# Altium schematic sheet SCH_2021-11-04.schdoc
size 319 x 219 mm
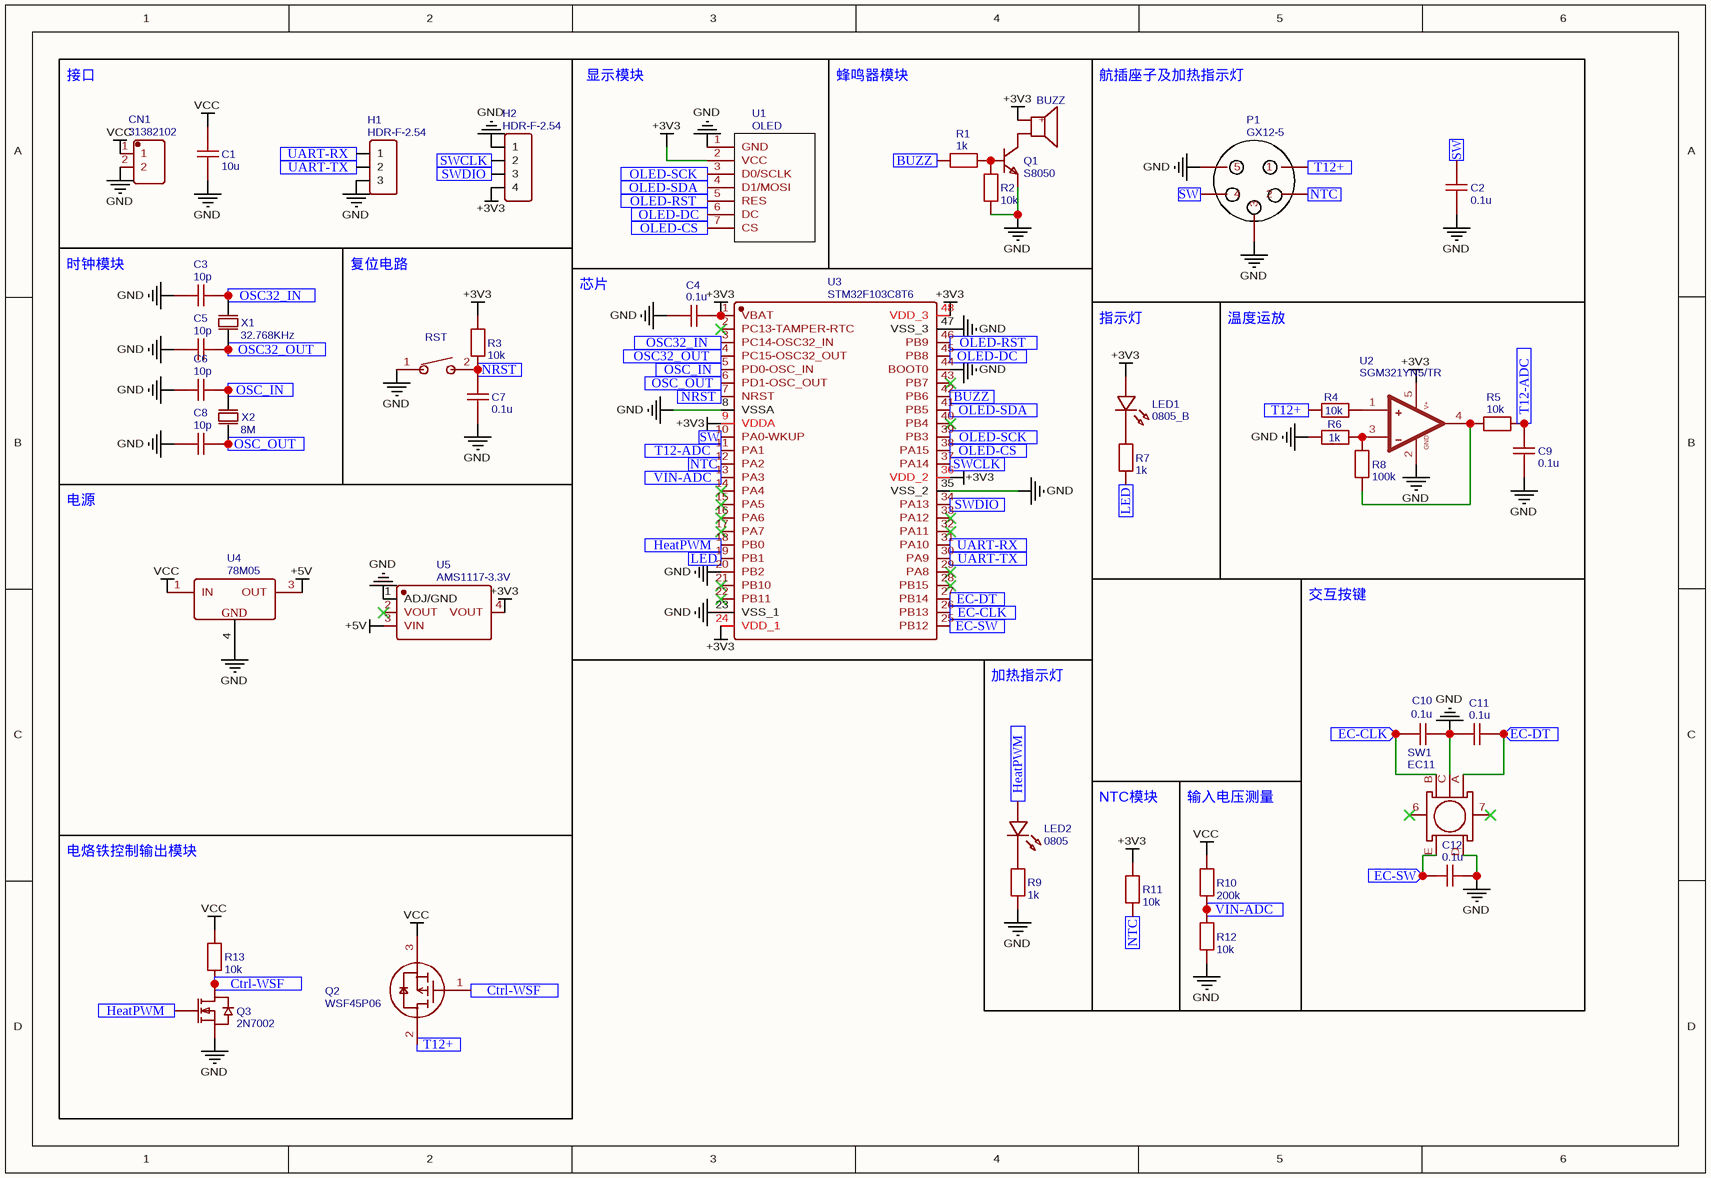
[diagram p0: SCH_2021-11-04.schdoc]

## Parts
BUZZ  TMB12A12  [BUZ-TH_BD12.0-P7.60-D0.6-FD]  (value not drawn)
C1  10u  [C0805]
C2  0.1u  [C0603]
C3  10p  [C0603]
C4  0.1u  [C0603]
C5  10p  [C0603]
C6  10p  [C0603]
C7  0.1u  [C0603]
C8  10p  [C0603]
C9  0.1u  [C0603]
C10  0.1u  [C0603]
C11  0.1u  [C0603]
C12  0.1u  [C0603]
CN1  31382102  [CONN-TH_2P-P3.81_31382102]
H1  HDR-F-2.54  [HDR-F-2.54_1X3]
H2  HDR-F-2.54  [HDR-F-2.54_1X4]
LED1  0805_B  [LED0603_BLUE]
LED2  0805  [LED0603_GREEN]
P1  GX12-5  [GX12-5]
Q1  S8050  [SOT-23-3_L2.9-W1.3-P1.90-LS2.4-TR]
Q2  WSF45P06  [TO-252-2_L6.6-W6.1-P4.57-LS9.9-TL-CW]
Q3  2N7002  [SOT-23-3_L2.9-W1.3-P1.90-LS2.4-BR]
R1  1k  [R0603]
R2  10k  [R0603]
R3  10k  [R0603]
R4  10k  [R0603]
R5  10k  [R0603]
R6  1k  [R0603]
R7  1k  [R0603]
R8  100k  [R0603]
R9  1k  [R0603]
R10  200k  [R0603]
R11  10k  [R0603]
R12  10k  [R0603]
R13  10k  [R0603]
RST  TSA343G00-250J2  [SW-SMD_L4.0-W2.9-LS5.0]  (value not drawn)
SW1  EC11  [SW-TH_EC11XXXXXXXX]
U1  OLED  [HDR-M-2.54_1X7]
U2  SGM321YN5/TR  [SOT-23-5_L3.0-W1.7-P0.95-LS2.8-BR]
U3  STM32F103C8T6  [LQFP-48_L7.0-W7.0-P0.50-LS9.0-BL]
U4  78M05  [TO-252-2_L6.5-W6.1-P4.58-LS10.0-TL]
U5  AMS1117-3.3V  [SOT-223-4_L6.5-W3.5-P2.30-LS7.0-BR]
X1  32.768KHz  [OSC-SMD_2P-L3.2-W1.5]
X2  8M  [OSC-SMD_L5.0-W3.2]

## Blocks framed on the sheet
接口: C1 CN1 H1 H2
显示模块: U1
蜂鸣器模块: BUZZ Q1 R1 R2
航插座子及加热指示灯: C2 P1
时钟模块: C3 C5 C6 C8 X1 X2
复位电路: C7 R3 RST
芯片: C4 U3
指示灯: LED1 R7
温度运放: C9 R4-R6 R8 U2
电源: U4 U5
交互按键: C10-C12 SW1
加热指示灯: LED2 R9
NTC模块: R11
输入电压测量: R10 R12
电烙铁控制输出模块: Q2 Q3 R13

## Ports
BUZZ (in), Ctrl-WSF (in), EC-CLK (in), EC-DT (in), EC-SW (in), HeatPWM (in), LED (in), NRST (in), NTC (in), OLED-CS (in), OLED-DC (in), OLED-RST (in), OLED-SCK (in), OLED-SDA (in), OSC32_IN (in), OSC32_OUT (in), OSC_IN (in), OSC_OUT (in), SW (in), SWCLK (in), SWDIO (in), T12+ (in), T12-ADC (in), UART-RX (in), UART-TX (in), VIN-ADC (in)

## Nets
+3V3: BUZZ.1(+) C4.2 H2.4 LED1.1 R3.2 R11.1 U1.2(VCC) U2.5(V+) U3.1(VBAT) U3.9(VDDA) U3.24(VDD_1) U3.36(VDD_2) U3.48(VDD_3) U5.4(VOUT)
+5V: U4.3(OUT) U5.3(VIN)
GND: C1.1 C2.1 C3.1 C4.1 C5.1 C6.1 C7.2 C8.1 C9.1 C10.2 C11.1 C12.2 CN1.2 H1.3 H2.1 P1.3 P1.5 Q1.1(E) Q3.2(S) R2.1 R6.1 R9.1 R12.1 RST.1 SW1.C SW1.D U1.1(GND) U2.2(GND) U3.8(VSSA) U3.20(PB2) U3.23(VSS_1) U3.35(VSS_2) U3.44(BOOT0) U3.47(VSS_3) U4.4(GND) U5.1(ADJ/GND)
VCC: C1.2 CN1.1 Q2.3(S) R10.2 R13.2 U4.1(IN)
BUZZ: R1.1 U3.42(PB6) ; port BUZZ
Ctrl-WSF: Q2.1(G) Q3.3(D) R13.1 ; port Ctrl-WSF
EC-CLK: C10.1 SW1.B U3.26(PB13) ; port EC-CLK
EC-DT: C11.2 SW1.A U3.27(PB14) ; port EC-DT
EC-SW: C12.1 SW1.E U3.25(PB12) ; port EC-SW
HeatPWM: LED2.1 Q3.1(G) U3.18(PB0) ; port HeatPWM
LED: R7.1 U3.19(PB1) ; port LED
NRST: C7.1 R3.1 RST.2 U3.7(NRST) ; port NRST
NTC: P1.2 R11.2 U3.12(PA2) ; port NTC
OLED-CS: U1.7(CS) U3.38(PA15) ; port OLED-CS
OLED-DC: U1.6(DC) U3.45(PB8) ; port OLED-DC
OLED-RST: U1.5(RES) U3.46(PB9) ; port OLED-RST
OLED-SCK: U1.3(D0/SCLK) U3.39(PB3) ; port OLED-SCK
OLED-SDA: U1.4(D1/MOSI) U3.41(PB5) ; port OLED-SDA
OSC32_IN: C3.2 U3.3(PC14-OSC32_IN) X1.2(OSC2) ; port OSC32_IN
OSC32_OUT: C5.2 U3.4(PC15-OSC32_OUT) X1.1(OSC1) ; port OSC32_OUT
OSC_IN: C6.2 U3.5(PD0-OSC_IN) X2.2(OSC2) ; port OSC_IN
OSC_OUT: C8.2 U3.6(PD1-OSC_OUT) X2.1(OSC1) ; port OSC_OUT
SW: C2.2 P1.4 U3.10(PA0-WKUP) ; port SW
SWCLK: H2.2 U3.37(PA14) ; port SWCLK
SWDIO: H2.3 U3.34(PA13) ; port SWDIO
T12+: P1.1 Q2.2(D) R4.1 ; port T12+
T12-ADC: C9.2 R5.2 U3.11(PA1) ; port T12-ADC
UART-RX: H1.1 U3.31(PA10) ; port UART-RX
UART-TX: H1.2 U3.30(PA9) ; port UART-TX
VIN-ADC: R10.1 R12.2 U3.13(PA3) ; port VIN-ADC
NetBUZZ_2: BUZZ.2 Q1.3(C)
NetLED1_2: LED1.2 R7.2
NetLED2_2: LED2.2 R9.2
NetQ1_2: Q1.2(B) R1.2 R2.2
NetR4_2: R4.2 U2.1(+)
NetR5_1: R5.1 R8.2 U2.4(OUT)
NetR6_2: R6.2 R8.1 U2.3(-)

Not connected (* = marked no-connect by the designer): SW1 6* 7*; U3 2(PC13-TAMPER-RTC)* 14(PA4)* 15(PA5)* 16(PA6)* 17(PA7)* 21(PB10)* 22(PB11)* 28(PB15)* 29(PA8)* 32(PA11)* 33(PA12)* 40(PB4)* 43(PB7)*; U5 2(VOUT)*

## Library data of the parts
BUZZ = TMB12A12: BOM_Manufacturer: HNDZ; BOM_Supplier: LCSC; BOM_Manufacturer Part: TMB12A12; BOM_Supplier Part: C96079; BOM_JLCPCB Part Class: Extended Part; spicePre: B; spiceSymbolName: TMB12A12
C1 = 10u: nameAlias: Value(F); Contributor: LCEDA_Lib; spicePre: C; spiceSymbolName: C_0805_US
C2 C4 C7 C9-C12 = 0.1u: nameAlias: Value(F); Contributor: LCEDA_Lib; spicePre: C
  C2: spiceSymbolName: C_0805_US
  C4 C7 C9-C12: spiceSymbolName: C_0603_US
C3 C5 C6 C8 = 10p: nameAlias: Value(F); Contributor: LCEDA_Lib; spicePre: C; spiceSymbolName: C_0603_US
CN1 = 31382102: BOM_Manufacturer: METZ CONNECT; Contributor: LCSC; BOM_Supplier: LCSC; BOM_Manufacturer Part: 31382102; BOM_Supplier Part: C123238; BOM_JLCPCB Part Class: Extended Part; spicePre: C; spiceSymbolName: 31382102
H1 H2 = HDR-F-2.54: Contributor: LCEDA_Lib; BOM_Supplier: LCSC; spicePre: H
  H1: BOM_Supplier Part: C146690; spiceSymbolName: HDR-F-2.54_1x3
  H2: BOM_Supplier Part: C225501; spiceSymbolName: HDR-F-2.54_1x4
LED1 = 0805_B: BOM_Manufacturer: 方舟 ARKLED; BOM_Manufacturer Part: D-B080508B1-KS2; Contributor: LCEDA_Lib; BOM_Supplier Part: C108412; spicePre: L; spiceSymbolName: LED-0805_B
LED2 = 0805: BOM_Manufacturer: 国星光电; BOM_Manufacturer Part: NCD0805G1; Contributor: LCEDA_Lib; BOM_Supplier Part: C84260; spicePre: L; spiceSymbolName: LED-0805_G
P1 = GX12-5: BOM_Manufacturer Part: GX16-5-01; Contributor: czwa; spicePre: P; spiceSymbolName: GX12-5
Q1 = S8050: BOM_Manufacturer: KEC; BOM_Manufacturer Part: 2n3904S-RTK/PS; BOM_Paste Type: SOT-23; Contributor: LCEDA_Lib; BOM_Supplier: LCSC; BOM_Supplier Part: C18536; spicePre: Q; spiceSymbolName: 2N3904(SOT-23)
Q2 = WSF45P06: BOM_Manufacturer: WINSOK; Contributor: LCSC; BOM_Supplier: LCSC; BOM_Manufacturer Part: WSF45P06; BOM_Supplier Part: C110923; BOM_JLCPCB Part Class: Extended Part; spicePre: Q; spiceSymbolName: WSF45P06
Q3 = 2N7002: BOM_Manufacturer: CJ; BOM_Supplier: LCSC; BOM_Manufacturer Part: 2N7002; BOM_Supplier Part: C8545; BOM_JLCPCB Part Class: Basic Part; spicePre: Q; spiceSymbolName: 2N7002
R1 R6 R7 R9 = 1k: nameAlias: Value(Ω); Contributor: LCEDA_Lib; spicePre: R; spiceSymbolName: R_0603_EU
R2-R5 R11-R13 = 10k: nameAlias: Value(Ω); Contributor: LCEDA_Lib; spicePre: R; spiceSymbolName: R_0603_EU
R8 = 100k: nameAlias: Value(Ω); Contributor: LCEDA_Lib; spicePre: R; spiceSymbolName: R_0603_EU
R10 = 200k: nameAlias: Value(Ω); Contributor: LCEDA_Lib; spicePre: R; spiceSymbolName: R_0603_EU
RST = TSA343G00-250J2: BOM_Manufacturer: BRIGHT; Contributor: LCSC; BOM_Supplier: LCSC; BOM_Supplier Part: C354946; BOM_Manufacturer Part: TSA343G00-250J2; spicePre: S; spiceSymbolName: TSA343G00-250J2
SW1 = EC11: BOM_Manufacturer: ALPS Electric; BOM_Manufacturer Part: EC11E15244B2; Contributor: LCSC; BOM_Supplier: LCSC; BOM_Supplier Part: C470754; BOM_JLCPCB Part Class: Extended Part; spicePre: S; spiceSymbolName: EC11E15244B2
U1 = OLED: Contributor: ou17; spicePre: U; spiceSymbolName: OLED
U2 = SGM321YN5/TR: BOM_Manufacturer: SGMICRO; BOM_Supplier: LCSC; BOM_Manufacturer Part: SGM321YN5/TR; BOM_Supplier Part: C28437; BOM_JLCPCB Part Class: Extended Part; spicePre: U; spiceSymbolName: SGM321YN5/TR
U3 = STM32F103C8T6: BOM_Manufacturer: STMicroelectronics; timeStamp: 1455028086; BOM_Supplier: LCSC; BOM_Manufacturer Part: STM32F103C8T6; BOM_Supplier Part: C8734; BOM_JLCPCB Part Class: Basic Part; spicePre: U; spiceSymbolName: STM32F103C8T6
U4 = 78M05: BOM_Manufacturer: SK; BOM_Supplier: LCSC; BOM_Manufacturer Part: 78M05; BOM_Supplier Part: C111265; BOM_JLCPCB Part Class: Extended Part; spicePre: U; spiceSymbolName: 78M05
U5 = AMS1117-3.3V: BOM_Manufacturer: WPMtek(维攀微); Contributor: LCSC; BOM_Supplier: LCSC; BOM_Supplier Part: C2688239; BOM_Manufacturer Part: AMS1117-3.3V; BOM_JLCPCB Part Class: Extended Part; spicePre: U; spiceSymbolName: AMS1117-3.3V
X1 = 32.768KHz: BOM_Manufacturer: SHENZHEN CRYSTAL TECH; BOM_Manufacturer Part: 7LC32768F07UC; nameAlias: Frequency; Contributor: LCSC; BOM_Supplier: LCSC; BOM_Supplier Part: C252399; BOM_JLCPCB Part Class: Extended Part; spicePre: X; spiceSymbolName: 7LC32768F07UC
X2 = 8M: BOM_Manufacturer: YXC; BOM_Manufacturer Part: X50328MSD2GC; Value: 8MHZ; BOM_Supplier Part: C18560; BOM_Supplier: LCSC; BOM_JLCPCB Part Class: Extended Part; spicePre: X; spiceSymbolName: X50328MSD2GC